# EAGLE design Button_Breakout_Schematic (EAGLE 9.7.0)
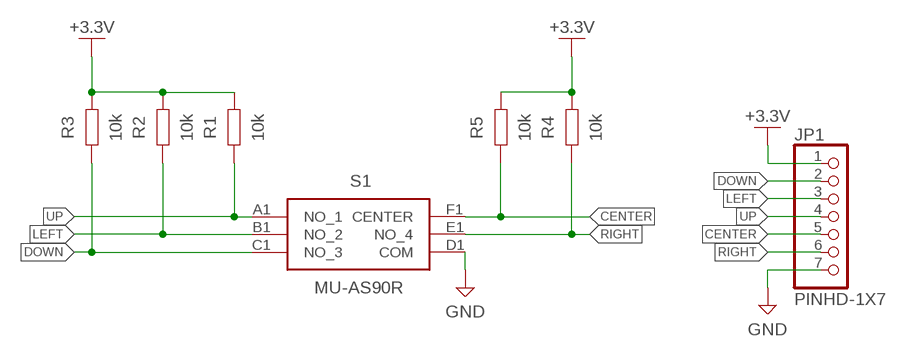
[diagram p0: schematic, sheet 1]

## Parts
JP1  PINHD-1X7  [1X07]
R1  10k  R_CHIP-0603(1608-METRIC)  [RESC1608X60]
R2  10k  R_CHIP-0603(1608-METRIC)  [RESC1608X60]
R3  10k  R_CHIP-0603(1608-METRIC)  [RESC1608X60]
R4  10k  R_CHIP-0603(1608-METRIC)  [RESC1608X60]
R5  10k  R_CHIP-0603(1608-METRIC)  [RESC1608X60]
S1  MU-AS90R  [MUAS90R]

## Nets
+3.3V: JP1.1 R1.2 R2.2 R3.2 R4.2 R5.2
CENTER: JP1.5 R5.1 S1.F1(CENTER)
DOWN: JP1.2 R3.1 S1.C1(NO_3)
GND: JP1.7 S1.D1(COM)
LEFT: JP1.3 R2.1 S1.B1(NO_2)
RIGHT: JP1.6 R4.1 S1.E1(NO_4)
UP: JP1.4 R1.1 S1.A1(NO_1)

## Library data of the parts
JP1 = Connector:PINHD-1X7: PIN HEADER; CATEGORY: Headers; DESCRIPTION: Header-Straight-7 Position; PACKAGE_TYPE: THT; PITCH: 0.100" (2.54mm); SUBCATEGORY: Headers-Male Pins; TYPE: Board to Board or Cable-Unshrouded-Through Hole-Straight
R1-R5 = Resistor:R: Resistor Fixed - Generic; CATEGORY: Resistors; DESCRIPTION: Chip Resistor 1.60 X 0.82 X 0.60 mm body 0603(1608-METRIC) Package; PACKAGE_SIZE: 0603; PACKAGE_TYPE: SMD
S1 = MU-AS90R:MU-AS90R: Multi-Directional Switches 5-way Switch, SMD, Height 9mm Source: Datasheet <https://www.apem.com/idec-apem/en_US/medias/PCB-MU-serie.pdf?context=bWFzdGVyfGRvY3VtZW50c3w0MTk2OTF8YXBwbGljYXRpb24vcGRmfGg2ZC9oMGEvOTQ2NDU3NTQyNjU5MC9QQ0JfTVVfc2VyaWUucGRmfDhmZDg0OWQ5ZjViYWFlZjljODY5ZmI3YmMzY2U3MzBjNmNiMzE0MzZkY2ZmMjQ4ZGRjNTJjOWQ0ZTc0NG>; DESCRIPTION: Multi-Directional Switches 5-way Switch, SMD, Height 9mm; HEIGHT: 9.2mm; MANUFACTURER_NAME: Apem; MANUFACTURER_PART_NUMBER: MU-AS90R; MOUSER_PART_NUMBER: 642-MU-AS90R; MOUSER_PRICE-STOCK: https://www.mouser.co.uk/ProductDetail/Apem/MU-AS90R?qs=mELouGlnn3cGEpjh4y0%2F8w%3D%3D

## Board
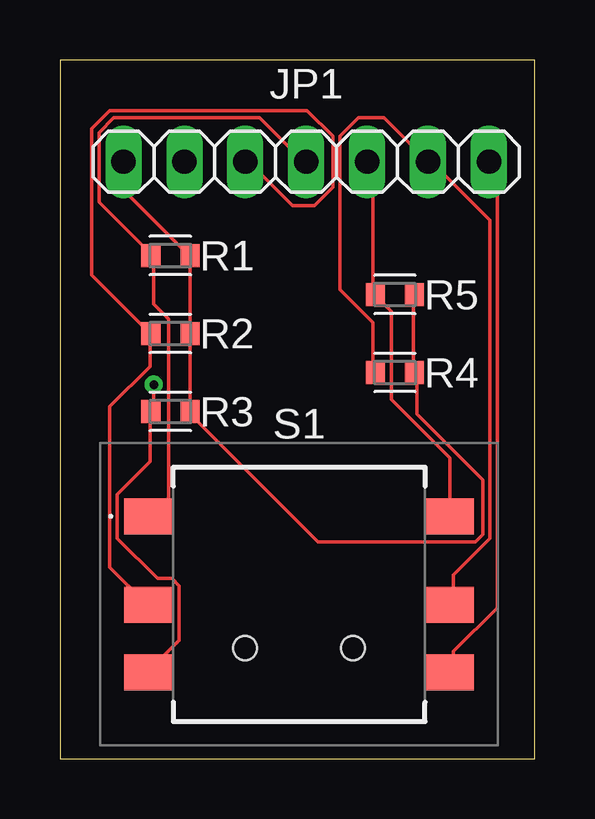
[diagram p1: board, top side]
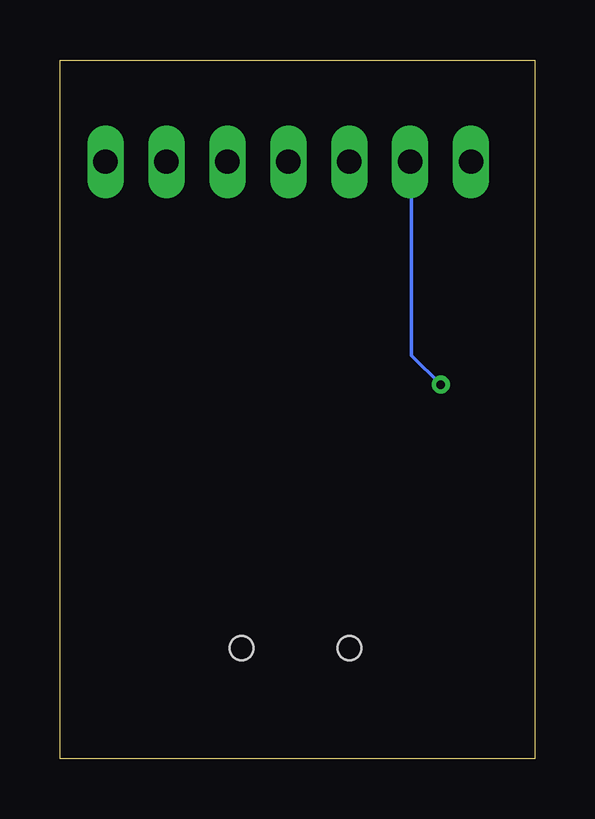
[diagram p2: board, bottom side, seen from below]

Size 19.79 x 29.13 mm. Coordinates in mm from the lower left corner, seen from the top.
Outline: 0,0 19.79,0 19.79,29.13 0,29.13 0,0
Copper layers (1*16): Top 0.035mm / dielectric 1.5mm / Bottom 0.035mm
Design rules "Fusion Electronics Design Rules": minimum track width 6mil, minimum drill 0.35mm, track to track 6mil, track to pad 6mil, pad to pad 6mil, via to via 6mil, smd to smd 6mil, copper to edge 40mil, drill to drill 6mil, minimum pad ring 10mil, minimum via ring 8mil, stop-mask expansion 4mil, vias tented up to drill 0mil, thermal gap 10mil

### Footprints (pad centres in the part's own frame; a part is rotated, then mirrored left to right if it is on the bottom)
1X07 = drill 1.016 long: 1 -7.62,0; 2 -5.08,0; 3 -2.54,0; 4 0,0; 5 2.54,0; 6 5.08,0; 7 7.62,0
RESC1608X60 = smd 0.799 x 0.974: 1 -0.815,0; 2 0.815,0
MUAS90R = smd 2 x 1.5: A1 -6.3,3.25; B1 -6.3,-0.45; C1 -6.3,-3.25; D1 6.3,-3.25; E1 6.3,-0.45; F1 6.3,3.25 | hole 1: -2.25,-2.25; 2.25,-2.25

### Placement (x,y rotation side)
JP1  10.27,24.89 0 top
R1  4.61,20.98 0 top
R2  4.61,17.73 0 top
R3  4.61,14.48 0 top
R4  13.97,16.1 0 top
R5  13.97,19.35 0 top
S1  9.97,6.86 0 top

### Tracks (layer width: path | path; a pad name or v marks a point on that pad's centre or on a via)
+3.3V
  Top 0.152: R5.2 14.73,19.25 14.73,16.2 R4.2 14.88,16.05 14.88,14.38 17.63,11.63 17.63,9.35 17.32,9.04 10.77,9.04 5.44,14.38 R3.2 5.44,14.53 5.44,17.58 R2.2 5.44,17.73 5.44,20.93 R1.2 5.28,21.08 2.69,23.67 2.69,24.89 JP1.1
CENTER
  Top 0.152: JP1.5 12.9,24.89 13.06,24.74 13.06,19.41 R5.1 13.21,19.25 13.82,18.64 13.82,14.99 16.26,12.55 16.26,10.11 S1.F1
DOWN  (via drill 0.35)
  Top 0.152: S1.C1 3.76,3.71 4.98,4.93 4.98,7.21 4.67,7.52 4.06,7.52 2.39,9.2 2.39,11.02 3.76,12.4 3.76,14.38 R3.1 3.91,14.53 v3.91,15.6
  Bottom 0.152: v3.91,15.6 5.13,16.81 5.13,24.89 JP1.2
GND
  Top 0.152: S1.D1 16.41,3.71 16.41,4.47 18.24,6.3 18.24,24.59 17.93,24.89 JP1.7
LEFT
  Top 0.152: S1.B1 3.61,6.45 2.08,7.98 2.08,14.68 3.76,16.36 3.76,17.58 R2.1 3.76,17.73 1.32,20.17 1.32,26.26 2.08,27.03 10.31,27.03 11.38,25.96 11.38,23.83 10.62,23.06 9.7,23.06 7.87,24.89 JP1.3
RIGHT
  Top 0.152: R4.1 13.06,16.2 13.06,18.19 11.68,19.56 11.68,25.96 12.45,26.72 13.51,26.72 JP1.6 15.49,24.89 17.93,22.45 17.93,9.2 16.41,7.67 16.41,6.45 S1.E1
UP
  Top 0.152: S1.A1 3.76,10.11 4.52,10.87 4.52,18.34 3.91,18.95 3.91,20.93 R1.1 3.76,21.08 1.63,23.22 1.63,26.11 2.23,26.72 8.33,26.72 10.16,24.89 JP1.4